# Altium project Switch_RF.PrjPCB
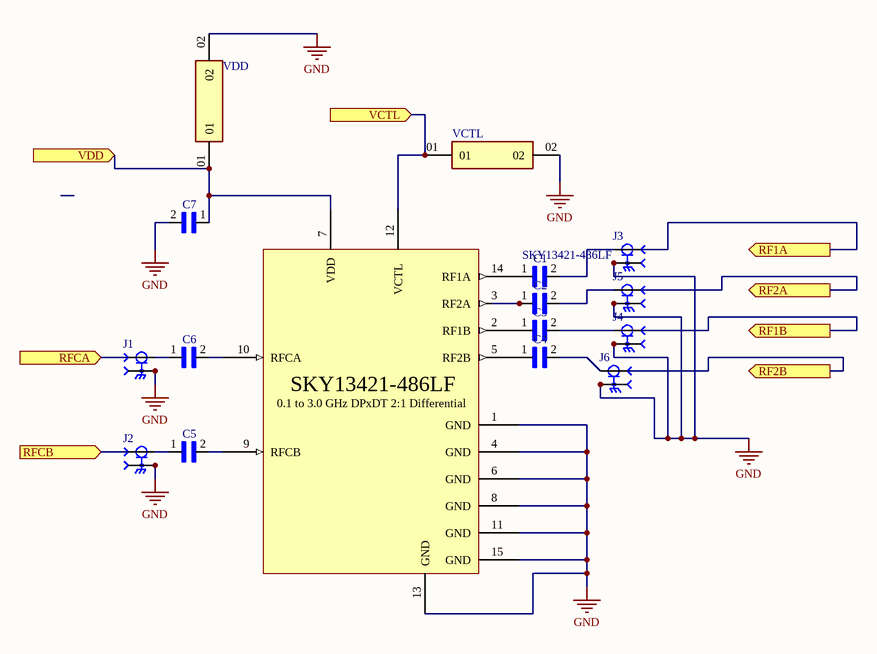
[diagram p0: switch_esquematico.SchDoc]
1 sheet, 16 parts. Net scope: flat (ports and power ports of the same name join across sheets).
Board file: switch_pcb.PcbDoc

## Sheet switch_esquematico.SchDoc
size A4

### Parts
C1  (no value)  [CAPC1608X90N]
C2  (no value)  [CAPC1608X90N]
C3  (no value)  [CAPC1608X90N]
C4  (no value)  [CAPC1608X90N]
C5  (no value)  [CAPC1608X90N]
C6  (no value)  [CAPC1608X90N]
C7  (no value)  [CAPC1608X90N]
J1  (no value)  [CINCH_142-0701-801]
J2  (no value)  [CINCH_142-0701-801]
J3  (no value)  [CINCH_142-0701-801]
J4  (no value)  [CINCH_142-0701-801]
J5  (no value)  [CINCH_142-0701-801]
J6  (no value)  [CINCH_142-0701-801]
VCTL  (no value)  [SAMTEC_MTMM-101-10-G-D-135]
VDD  (no value)  [SAMTEC_MTMM-101-10-G-D-135]
  SKY13421-486LF  [SKY13421_486LF]

### Ports
RF1A (out), RF1B (out), RF2A (out), RF2B (out), RFCA (in), RFCB (in), VCTL (in), VDD (in)

### Nets
GND: C7.2 J1.S1 J1.S2 J1.S3 J1.S4 J2.S1 J2.S2 J2.S3 J2.S4 J3.S1 J3.S2 J3.S3 J3.S4 J4.S1 J4.S2 J4.S3 J4.S4 J5.S1 J5.S2 J5.S3 J5.S4 J6.S1 J6.S2 J6.S3 J6.S4 VCTL.02 VDD.02 .1(GND) .4(GND) .6(GND) .8(GND) .11(GND) .13(GND) .15(GND)
NetC1_1: C1.1 .14(RF1A)
NetC1_2: C1.2 J3.1
NetC2_1: C2.1 .3(RF2A)
NetC2_2: C2.2 J5.1
NetC3_1: C3.1 .2(RF1B)
NetC3_2: C3.2 J4.1
NetC4_1: C4.1 .5(RF2B)
NetC4_2: C4.2 J6.1
NetC5_1: C5.1 J2.1
NetC5_2: C5.2 .9(RFCB)
NetC6_1: C6.1 J1.1
NetC6_2: C6.2 .10(RFCA)
NetC7_1: C7.1 VDD.01 .7(VDD) ; port VDD
NetVCTL_01: VCTL.01 .12(VCTL) ; port VCTL

### Notes on the sheet
- (in symbol SKY13421-486LF) 0.1 to 3.0 GHz DPxDT 2:1 Differential

### Library data of the parts
C1-C7 = C1608C0G1H102J080AA: 1000pF Â±5% 50V Ceramic Capacitor C0G, NP0 0603 (1608 Metric); MF: TDK; MP: C1608C0G1H102J080AA; Purchase-URL: https://pricing.snapeda.com/search/part/C1608C0G1H102J080AA/?ref=eda; Price: None; SnapEDA_Link: https://www.snapeda.com/parts/C1608C0G1H102J080AA/TDK-Lambda+Americas+Inc/view-part/?ref=snap; Check_prices: https://www.snapeda.com/parts/C1608C0G1H102J080AA/TDK-Lambda+Americas+Inc/view-part/?ref=eda; Package: 1608 TDK; Availability: In Stock; Value: *
J1-J6 = 142-0701-801: SMA Jack | End Launch | Round Contact; MF: Cinch Connectivity; Price: None; Package: None; Value: *; MP: 142-0701-801; Availability: Unavailable; SnapEDA_Link: https://www.snapeda.com/parts/142-0701-801/Cinch%20Connectivity%20Solutions%20Johnson/view-part/107536/?ref=snap
VCTL VDD = MTMM-101-10-G-D-135: Connector Header Through Hole 2 position; MF: Samtec; Availability: In Stock; Value: *; Price: None; Check_prices: https://www.snapeda.com/parts/MTMM-101-10-G-D-135/Samtec/view-part/?ref=eda; MP: MTMM-101-10-G-D-135; Package: None; Purchase-URL: https://pricing.snapeda.com/search/part/MTMM-101-10-G-D-135/?ref=eda; SnapEDA_Link: https://www.snapeda.com/parts/MTMM-101-10-G-D-135/Samtec/view-part/?ref=snap
 = SKY13421-486LF: 0.1 to 3.0 GHz DPxDT 2:1 Differential Switch